# EAGLE design EIB-128 (EAGLE 7.1.0)
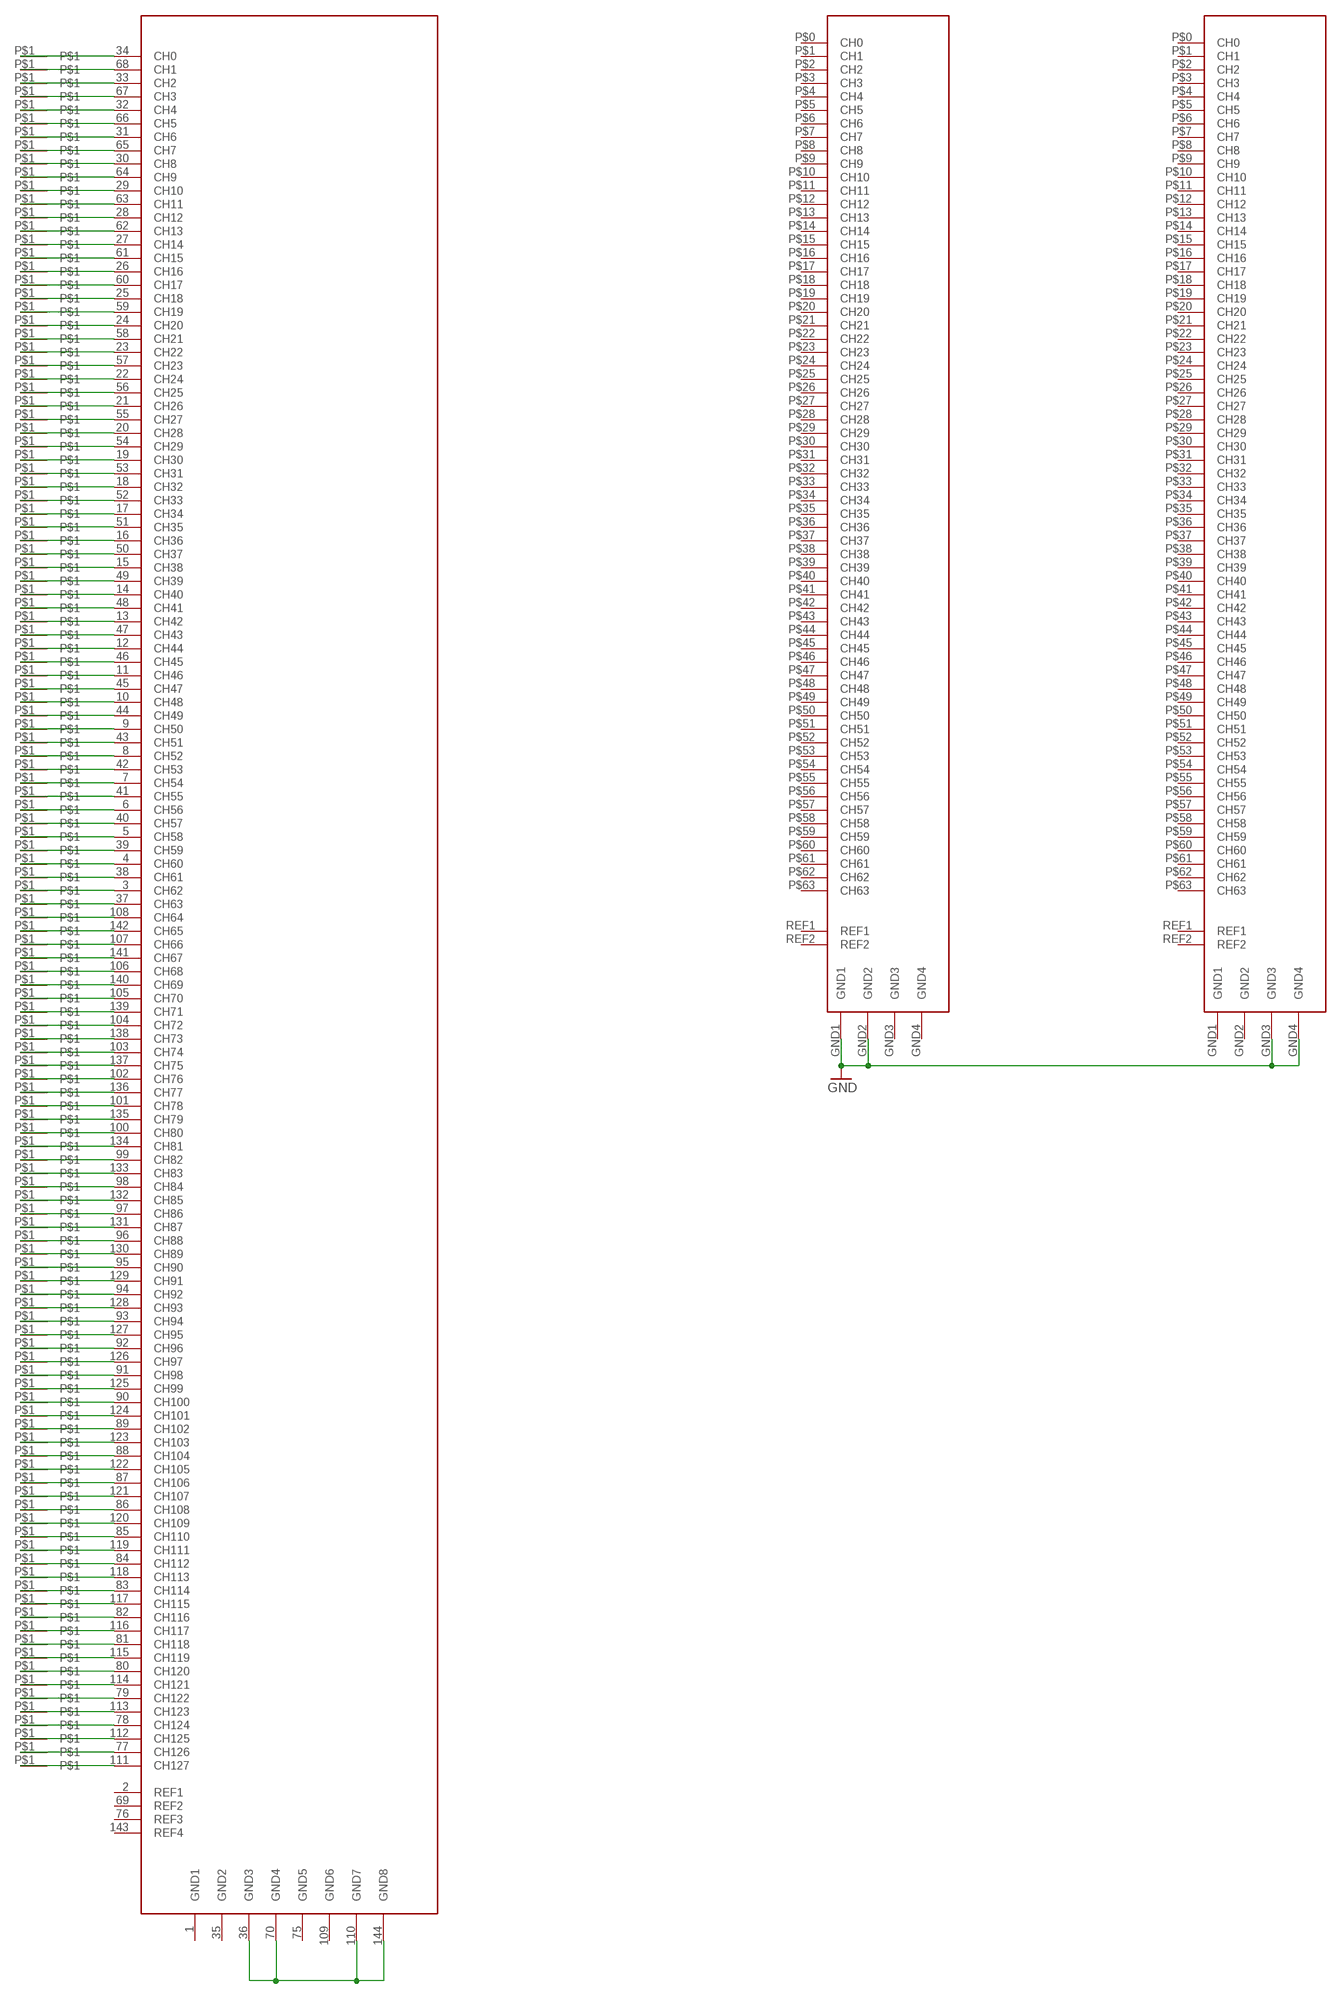
[diagram p0: schematic, sheet 1]

## Parts
H$0  TARRAYSHUTTLEHOLE  [TARRAYSHUTTLEHOLE]
H$1  TARRAYSHUTTLEHOLE  [TARRAYSHUTTLEHOLE]
H$2  TARRAYSHUTTLEHOLE  [TARRAYSHUTTLEHOLE]
H$3  TARRAYSHUTTLEHOLE  [TARRAYSHUTTLEHOLE]
H$4  TARRAYSHUTTLEHOLE  [TARRAYSHUTTLEHOLE]
H$5  TARRAYSHUTTLEHOLE  [TARRAYSHUTTLEHOLE]
H$6  TARRAYSHUTTLEHOLE  [TARRAYSHUTTLEHOLE]
H$7  TARRAYSHUTTLEHOLE  [TARRAYSHUTTLEHOLE]
H$8  TARRAYSHUTTLEHOLE  [TARRAYSHUTTLEHOLE]
H$9  TARRAYSHUTTLEHOLE  [TARRAYSHUTTLEHOLE]
H$10  TARRAYSHUTTLEHOLE  [TARRAYSHUTTLEHOLE]
H$11  TARRAYSHUTTLEHOLE  [TARRAYSHUTTLEHOLE]
H$12  TARRAYSHUTTLEHOLE  [TARRAYSHUTTLEHOLE]
H$13  TARRAYSHUTTLEHOLE  [TARRAYSHUTTLEHOLE]
H$14  TARRAYSHUTTLEHOLE  [TARRAYSHUTTLEHOLE]
H$15  TARRAYSHUTTLEHOLE  [TARRAYSHUTTLEHOLE]
H$16  TARRAYSHUTTLEHOLE  [TARRAYSHUTTLEHOLE]
H$17  TARRAYSHUTTLEHOLE  [TARRAYSHUTTLEHOLE]
H$18  TARRAYSHUTTLEHOLE  [TARRAYSHUTTLEHOLE]
H$19  TARRAYSHUTTLEHOLE  [TARRAYSHUTTLEHOLE]
H$20  TARRAYSHUTTLEHOLE  [TARRAYSHUTTLEHOLE]
H$21  TARRAYSHUTTLEHOLE  [TARRAYSHUTTLEHOLE]
H$22  TARRAYSHUTTLEHOLE  [TARRAYSHUTTLEHOLE]
H$23  TARRAYSHUTTLEHOLE  [TARRAYSHUTTLEHOLE]
H$24  TARRAYSHUTTLEHOLE  [TARRAYSHUTTLEHOLE]
H$25  TARRAYSHUTTLEHOLE  [TARRAYSHUTTLEHOLE]
H$26  TARRAYSHUTTLEHOLE  [TARRAYSHUTTLEHOLE]
H$27  TARRAYSHUTTLEHOLE  [TARRAYSHUTTLEHOLE]
H$28  TARRAYSHUTTLEHOLE  [TARRAYSHUTTLEHOLE]
H$29  TARRAYSHUTTLEHOLE  [TARRAYSHUTTLEHOLE]
H$30  TARRAYSHUTTLEHOLE  [TARRAYSHUTTLEHOLE]
H$31  TARRAYSHUTTLEHOLE  [TARRAYSHUTTLEHOLE]
H$32  TARRAYSHUTTLEHOLE  [TARRAYSHUTTLEHOLE]
H$33  TARRAYSHUTTLEHOLE  [TARRAYSHUTTLEHOLE]
H$34  TARRAYSHUTTLEHOLE  [TARRAYSHUTTLEHOLE]
H$35  TARRAYSHUTTLEHOLE  [TARRAYSHUTTLEHOLE]
H$36  TARRAYSHUTTLEHOLE  [TARRAYSHUTTLEHOLE]
H$37  TARRAYSHUTTLEHOLE  [TARRAYSHUTTLEHOLE]
H$38  TARRAYSHUTTLEHOLE  [TARRAYSHUTTLEHOLE]
H$39  TARRAYSHUTTLEHOLE  [TARRAYSHUTTLEHOLE]
H$40  TARRAYSHUTTLEHOLE  [TARRAYSHUTTLEHOLE]
H$41  TARRAYSHUTTLEHOLE  [TARRAYSHUTTLEHOLE]
H$42  TARRAYSHUTTLEHOLE  [TARRAYSHUTTLEHOLE]
H$43  TARRAYSHUTTLEHOLE  [TARRAYSHUTTLEHOLE]
H$44  TARRAYSHUTTLEHOLE  [TARRAYSHUTTLEHOLE]
H$45  TARRAYSHUTTLEHOLE  [TARRAYSHUTTLEHOLE]
H$46  TARRAYSHUTTLEHOLE  [TARRAYSHUTTLEHOLE]
H$47  TARRAYSHUTTLEHOLE  [TARRAYSHUTTLEHOLE]
H$48  TARRAYSHUTTLEHOLE  [TARRAYSHUTTLEHOLE]
H$49  TARRAYSHUTTLEHOLE  [TARRAYSHUTTLEHOLE]
H$50  TARRAYSHUTTLEHOLE  [TARRAYSHUTTLEHOLE]
H$51  TARRAYSHUTTLEHOLE  [TARRAYSHUTTLEHOLE]
H$52  TARRAYSHUTTLEHOLE  [TARRAYSHUTTLEHOLE]
H$53  TARRAYSHUTTLEHOLE  [TARRAYSHUTTLEHOLE]
H$54  TARRAYSHUTTLEHOLE  [TARRAYSHUTTLEHOLE]
H$55  TARRAYSHUTTLEHOLE  [TARRAYSHUTTLEHOLE]
H$56  TARRAYSHUTTLEHOLE  [TARRAYSHUTTLEHOLE]
H$57  TARRAYSHUTTLEHOLE  [TARRAYSHUTTLEHOLE]
H$58  TARRAYSHUTTLEHOLE  [TARRAYSHUTTLEHOLE]
H$59  TARRAYSHUTTLEHOLE  [TARRAYSHUTTLEHOLE]
H$60  TARRAYSHUTTLEHOLE  [TARRAYSHUTTLEHOLE]
H$61  TARRAYSHUTTLEHOLE  [TARRAYSHUTTLEHOLE]
H$62  TARRAYSHUTTLEHOLE  [TARRAYSHUTTLEHOLE]
H$63  TARRAYSHUTTLEHOLE  [TARRAYSHUTTLEHOLE]
H$64  TARRAYSHUTTLEHOLE  [TARRAYSHUTTLEHOLE]
H$65  TARRAYSHUTTLEHOLE  [TARRAYSHUTTLEHOLE]
H$66  TARRAYSHUTTLEHOLE  [TARRAYSHUTTLEHOLE]
H$67  TARRAYSHUTTLEHOLE  [TARRAYSHUTTLEHOLE]
H$68  TARRAYSHUTTLEHOLE  [TARRAYSHUTTLEHOLE]
H$69  TARRAYSHUTTLEHOLE  [TARRAYSHUTTLEHOLE]
H$70  TARRAYSHUTTLEHOLE  [TARRAYSHUTTLEHOLE]
H$71  TARRAYSHUTTLEHOLE  [TARRAYSHUTTLEHOLE]
H$72  TARRAYSHUTTLEHOLE  [TARRAYSHUTTLEHOLE]
H$73  TARRAYSHUTTLEHOLE  [TARRAYSHUTTLEHOLE]
H$74  TARRAYSHUTTLEHOLE  [TARRAYSHUTTLEHOLE]
H$75  TARRAYSHUTTLEHOLE  [TARRAYSHUTTLEHOLE]
H$76  TARRAYSHUTTLEHOLE  [TARRAYSHUTTLEHOLE]
H$77  TARRAYSHUTTLEHOLE  [TARRAYSHUTTLEHOLE]
H$78  TARRAYSHUTTLEHOLE  [TARRAYSHUTTLEHOLE]
H$79  TARRAYSHUTTLEHOLE  [TARRAYSHUTTLEHOLE]
H$80  TARRAYSHUTTLEHOLE  [TARRAYSHUTTLEHOLE]
H$81  TARRAYSHUTTLEHOLE  [TARRAYSHUTTLEHOLE]
H$82  TARRAYSHUTTLEHOLE  [TARRAYSHUTTLEHOLE]
H$83  TARRAYSHUTTLEHOLE  [TARRAYSHUTTLEHOLE]
H$84  TARRAYSHUTTLEHOLE  [TARRAYSHUTTLEHOLE]
H$85  TARRAYSHUTTLEHOLE  [TARRAYSHUTTLEHOLE]
H$86  TARRAYSHUTTLEHOLE  [TARRAYSHUTTLEHOLE]
H$87  TARRAYSHUTTLEHOLE  [TARRAYSHUTTLEHOLE]
H$88  TARRAYSHUTTLEHOLE  [TARRAYSHUTTLEHOLE]
H$89  TARRAYSHUTTLEHOLE  [TARRAYSHUTTLEHOLE]
H$90  TARRAYSHUTTLEHOLE  [TARRAYSHUTTLEHOLE]
H$91  TARRAYSHUTTLEHOLE  [TARRAYSHUTTLEHOLE]
H$92  TARRAYSHUTTLEHOLE  [TARRAYSHUTTLEHOLE]
H$93  TARRAYSHUTTLEHOLE  [TARRAYSHUTTLEHOLE]
H$94  TARRAYSHUTTLEHOLE  [TARRAYSHUTTLEHOLE]
H$95  TARRAYSHUTTLEHOLE  [TARRAYSHUTTLEHOLE]
H$96  TARRAYSHUTTLEHOLE  [TARRAYSHUTTLEHOLE]
H$97  TARRAYSHUTTLEHOLE  [TARRAYSHUTTLEHOLE]
H$98  TARRAYSHUTTLEHOLE  [TARRAYSHUTTLEHOLE]
H$99  TARRAYSHUTTLEHOLE  [TARRAYSHUTTLEHOLE]
H$100  TARRAYSHUTTLEHOLE  [TARRAYSHUTTLEHOLE]
H$101  TARRAYSHUTTLEHOLE  [TARRAYSHUTTLEHOLE]
H$102  TARRAYSHUTTLEHOLE  [TARRAYSHUTTLEHOLE]
H$103  TARRAYSHUTTLEHOLE  [TARRAYSHUTTLEHOLE]
H$104  TARRAYSHUTTLEHOLE  [TARRAYSHUTTLEHOLE]
H$105  TARRAYSHUTTLEHOLE  [TARRAYSHUTTLEHOLE]
H$106  TARRAYSHUTTLEHOLE  [TARRAYSHUTTLEHOLE]
H$107  TARRAYSHUTTLEHOLE  [TARRAYSHUTTLEHOLE]
H$108  TARRAYSHUTTLEHOLE  [TARRAYSHUTTLEHOLE]
H$109  TARRAYSHUTTLEHOLE  [TARRAYSHUTTLEHOLE]
H$110  TARRAYSHUTTLEHOLE  [TARRAYSHUTTLEHOLE]
H$111  TARRAYSHUTTLEHOLE  [TARRAYSHUTTLEHOLE]
H$112  TARRAYSHUTTLEHOLE  [TARRAYSHUTTLEHOLE]
H$113  TARRAYSHUTTLEHOLE  [TARRAYSHUTTLEHOLE]
H$114  TARRAYSHUTTLEHOLE  [TARRAYSHUTTLEHOLE]
H$115  TARRAYSHUTTLEHOLE  [TARRAYSHUTTLEHOLE]
H$116  TARRAYSHUTTLEHOLE  [TARRAYSHUTTLEHOLE]
H$117  TARRAYSHUTTLEHOLE  [TARRAYSHUTTLEHOLE]
H$118  TARRAYSHUTTLEHOLE  [TARRAYSHUTTLEHOLE]
H$119  TARRAYSHUTTLEHOLE  [TARRAYSHUTTLEHOLE]
H$120  TARRAYSHUTTLEHOLE  [TARRAYSHUTTLEHOLE]
H$121  TARRAYSHUTTLEHOLE  [TARRAYSHUTTLEHOLE]
H$122  TARRAYSHUTTLEHOLE  [TARRAYSHUTTLEHOLE]
H$123  TARRAYSHUTTLEHOLE  [TARRAYSHUTTLEHOLE]
H$124  TARRAYSHUTTLEHOLE  [TARRAYSHUTTLEHOLE]
H$125  TARRAYSHUTTLEHOLE  [TARRAYSHUTTLEHOLE]
H$126  TARRAYSHUTTLEHOLE  [TARRAYSHUTTLEHOLE]
H$127  TARRAYSHUTTLEHOLE  [TARRAYSHUTTLEHOLE]
U$1  DF40C-70DP  [DF40C-70DP]
U$2  DF40C-70DP  [DF40C-70DP]
U$3  128CH-MODULE  [128CH-MODULE]

## Nets
GND: U$1.GND1 U$1.GND2 U$2.GND3 U$2.GND4
N$1: H$0.P$1 U$3.34(CH0)
N$2: H$1.P$1 U$3.68(CH1)
N$3: H$2.P$1 U$3.33(CH2)
N$4: H$3.P$1 U$3.67(CH3)
N$5: H$4.P$1 U$3.32(CH4)
N$6: H$5.P$1 U$3.66(CH5)
N$7: H$6.P$1 U$3.31(CH6)
N$8: H$7.P$1 U$3.65(CH7)
N$9: H$8.P$1 U$3.30(CH8)
N$10: H$9.P$1 U$3.64(CH9)
N$11: H$10.P$1 U$3.29(CH10)
N$12: H$11.P$1 U$3.63(CH11)
N$13: H$12.P$1 U$3.28(CH12)
N$14: H$13.P$1 U$3.62(CH13)
N$15: H$14.P$1 U$3.27(CH14)
N$16: H$15.P$1 U$3.61(CH15)
N$17: H$16.P$1 U$3.26(CH16)
N$18: H$17.P$1 U$3.60(CH17)
N$19: H$18.P$1 U$3.25(CH18)
N$20: H$19.P$1 U$3.59(CH19)
N$21: H$20.P$1 U$3.24(CH20)
N$22: H$21.P$1 U$3.58(CH21)
N$23: H$22.P$1 U$3.23(CH22)
N$24: H$23.P$1 U$3.57(CH23)
N$25: H$24.P$1 U$3.22(CH24)
N$26: H$25.P$1 U$3.56(CH25)
N$27: H$26.P$1 U$3.21(CH26)
N$28: H$27.P$1 U$3.55(CH27)
N$29: H$28.P$1 U$3.20(CH28)
N$30: H$29.P$1 U$3.54(CH29)
N$31: H$30.P$1 U$3.19(CH30)
N$32: H$31.P$1 U$3.53(CH31)
N$33: H$32.P$1 U$3.18(CH32)
N$34: H$33.P$1 U$3.52(CH33)
N$35: H$34.P$1 U$3.17(CH34)
N$36: H$35.P$1 U$3.51(CH35)
N$37: H$36.P$1 U$3.16(CH36)
N$38: H$37.P$1 U$3.50(CH37)
N$39: H$38.P$1 U$3.15(CH38)
N$40: H$39.P$1 U$3.49(CH39)
N$41: H$40.P$1 U$3.14(CH40)
N$42: H$41.P$1 U$3.48(CH41)
N$43: H$42.P$1 U$3.13(CH42)
N$44: H$43.P$1 U$3.47(CH43)
N$45: H$44.P$1 U$3.12(CH44)
N$46: H$45.P$1 U$3.46(CH45)
N$47: H$46.P$1 U$3.11(CH46)
N$48: H$47.P$1 U$3.45(CH47)
N$49: H$48.P$1 U$3.10(CH48)
N$50: H$49.P$1 U$3.44(CH49)
N$51: H$50.P$1 U$3.9(CH50)
N$52: H$51.P$1 U$3.43(CH51)
N$53: H$52.P$1 U$3.8(CH52)
N$54: H$53.P$1 U$3.42(CH53)
N$55: H$54.P$1 U$3.7(CH54)
N$56: H$55.P$1 U$3.41(CH55)
N$57: H$56.P$1 U$3.6(CH56)
N$58: H$57.P$1 U$3.40(CH57)
N$59: H$58.P$1 U$3.5(CH58)
N$60: H$59.P$1 U$3.39(CH59)
N$61: H$60.P$1 U$3.4(CH60)
N$62: H$61.P$1 U$3.38(CH61)
N$63: H$62.P$1 U$3.3(CH62)
N$64: H$63.P$1 U$3.37(CH63)
N$65: H$64.P$1 U$3.108(CH64)
N$66: H$65.P$1 U$3.142(CH65)
N$67: H$66.P$1 U$3.107(CH66)
N$68: H$67.P$1 U$3.141(CH67)
N$69: H$68.P$1 U$3.106(CH68)
N$70: H$69.P$1 U$3.140(CH69)
N$71: H$70.P$1 U$3.105(CH70)
N$72: H$71.P$1 U$3.139(CH71)
N$73: H$72.P$1 U$3.104(CH72)
N$74: H$73.P$1 U$3.138(CH73)
N$75: H$74.P$1 U$3.103(CH74)
N$76: H$75.P$1 U$3.137(CH75)
N$77: H$76.P$1 U$3.102(CH76)
N$78: H$77.P$1 U$3.136(CH77)
N$79: H$78.P$1 U$3.101(CH78)
N$80: H$79.P$1 U$3.135(CH79)
N$81: H$80.P$1 U$3.100(CH80)
N$82: H$81.P$1 U$3.134(CH81)
N$83: H$82.P$1 U$3.99(CH82)
N$84: H$83.P$1 U$3.133(CH83)
N$85: H$84.P$1 U$3.98(CH84)
N$86: H$85.P$1 U$3.132(CH85)
N$87: H$86.P$1 U$3.97(CH86)
N$88: H$87.P$1 U$3.131(CH87)
N$89: H$88.P$1 U$3.96(CH88)
N$90: H$89.P$1 U$3.130(CH89)
N$91: H$90.P$1 U$3.95(CH90)
N$92: H$91.P$1 U$3.129(CH91)
N$93: H$92.P$1 U$3.94(CH92)
N$94: H$93.P$1 U$3.128(CH93)
N$95: H$94.P$1 U$3.93(CH94)
N$96: H$95.P$1 U$3.127(CH95)
N$97: H$96.P$1 U$3.92(CH96)
N$98: H$97.P$1 U$3.126(CH97)
N$99: H$98.P$1 U$3.91(CH98)
N$100: H$99.P$1 U$3.125(CH99)
N$101: H$100.P$1 U$3.90(CH100)
N$102: H$101.P$1 U$3.124(CH101)
N$103: H$102.P$1 U$3.89(CH102)
N$104: H$103.P$1 U$3.123(CH103)
N$105: H$104.P$1 U$3.88(CH104)
N$106: H$105.P$1 U$3.122(CH105)
N$107: H$106.P$1 U$3.87(CH106)
N$108: H$107.P$1 U$3.121(CH107)
N$109: H$108.P$1 U$3.86(CH108)
N$110: H$109.P$1 U$3.120(CH109)
N$111: H$110.P$1 U$3.85(CH110)
N$112: H$111.P$1 U$3.119(CH111)
N$113: H$112.P$1 U$3.84(CH112)
N$114: H$113.P$1 U$3.118(CH113)
N$115: H$114.P$1 U$3.83(CH114)
N$116: H$115.P$1 U$3.117(CH115)
N$117: H$116.P$1 U$3.82(CH116)
N$118: H$117.P$1 U$3.116(CH117)
N$119: H$118.P$1 U$3.81(CH118)
N$120: H$119.P$1 U$3.115(CH119)
N$121: H$120.P$1 U$3.80(CH120)
N$122: H$121.P$1 U$3.114(CH121)
N$123: H$122.P$1 U$3.79(CH122)
N$124: H$123.P$1 U$3.113(CH123)
N$125: H$124.P$1 U$3.78(CH124)
N$126: H$125.P$1 U$3.112(CH125)
N$127: H$126.P$1 U$3.77(CH126)
N$128: H$127.P$1 U$3.111(CH127)
N$130: U$3.36(GND3) U$3.70(GND4) U$3.110(GND7) U$3.144(GND8)
Unconnected: U$1.GND3 U$1.GND4 U$1.P$0(CH0) U$1.P$1(CH1) U$1.P$2(CH2) U$1.P$3(CH3) U$1.P$4(CH4) U$1.P$5(CH5) U$1.P$6(CH6) U$1.P$7(CH7) U$1.P$8(CH8) U$1.P$9(CH9) U$1.P$10(CH10) U$1.P$11(CH11) U$1.P$12(CH12) U$1.P$13(CH13) U$1.P$14(CH14) U$1.P$15(CH15) U$1.P$16(CH16) U$1.P$17(CH17) U$1.P$18(CH18) U$1.P$19(CH19) U$1.P$20(CH20) U$1.P$21(CH21) U$1.P$22(CH22) U$1.P$23(CH23) U$1.P$24(CH24) U$1.P$25(CH25) U$1.P$26(CH26) U$1.P$27(CH27) U$1.P$28(CH28) U$1.P$29(CH29) U$1.P$30(CH30) U$1.P$31(CH31) U$1.P$32(CH32) U$1.P$33(CH33) U$1.P$34(CH34) U$1.P$35(CH35) U$1.P$36(CH36) U$1.P$37(CH37) U$1.P$38(CH38) U$1.P$39(CH39) U$1.P$40(CH40) U$1.P$41(CH41) U$1.P$42(CH42) U$1.P$43(CH43) U$1.P$44(CH44) U$1.P$45(CH45) U$1.P$46(CH46) U$1.P$47(CH47) U$1.P$48(CH48) U$1.P$49(CH49) U$1.P$50(CH50) U$1.P$51(CH51) U$1.P$52(CH52) U$1.P$53(CH53) U$1.P$54(CH54) U$1.P$55(CH55) U$1.P$56(CH56) U$1.P$57(CH57) U$1.P$58(CH58) U$1.P$59(CH59) U$1.P$60(CH60) U$1.P$61(CH61) U$1.P$62(CH62) U$1.P$63(CH63) U$1.REF1 U$1.REF2 U$2.GND1 U$2.GND2 U$2.P$0(CH0) U$2.P$1(CH1) U$2.P$2(CH2) U$2.P$3(CH3) U$2.P$4(CH4) U$2.P$5(CH5) U$2.P$6(CH6) U$2.P$7(CH7) U$2.P$8(CH8) U$2.P$9(CH9) U$2.P$10(CH10) U$2.P$11(CH11) U$2.P$12(CH12) U$2.P$13(CH13) U$2.P$14(CH14) U$2.P$15(CH15) U$2.P$16(CH16) U$2.P$17(CH17) U$2.P$18(CH18) U$2.P$19(CH19) U$2.P$20(CH20) U$2.P$21(CH21) U$2.P$22(CH22) U$2.P$23(CH23) U$2.P$24(CH24) U$2.P$25(CH25) U$2.P$26(CH26) U$2.P$27(CH27) U$2.P$28(CH28) U$2.P$29(CH29) U$2.P$30(CH30) U$2.P$31(CH31) U$2.P$32(CH32) U$2.P$33(CH33) U$2.P$34(CH34) U$2.P$35(CH35) U$2.P$36(CH36) U$2.P$37(CH37) U$2.P$38(CH38) U$2.P$39(CH39) U$2.P$40(CH40) U$2.P$41(CH41) U$2.P$42(CH42) U$2.P$43(CH43) U$2.P$44(CH44) U$2.P$45(CH45) U$2.P$46(CH46) U$2.P$47(CH47) U$2.P$48(CH48) U$2.P$49(CH49) U$2.P$50(CH50) U$2.P$51(CH51) U$2.P$52(CH52) U$2.P$53(CH53) U$2.P$54(CH54) U$2.P$55(CH55) U$2.P$56(CH56) U$2.P$57(CH57) U$2.P$58(CH58) U$2.P$59(CH59) U$2.P$60(CH60) U$2.P$61(CH61) U$2.P$62(CH62) U$2.P$63(CH63) U$2.REF1 U$2.REF2 U$3.2(REF1) U$3.69(REF2) U$3.76(REF3) U$3.143(REF4)

## Power pins joined to a net without a drawn wire
GND1: U$3.1(GND1)
GND2: U$3.35(GND2)
GND5: U$3.75(GND5)
GND6: U$3.109(GND6)

## Library data of the parts
H$0 H$1-H$127 = drive-parts:TARRAYSHUTTLEHOLE
U$1 U$2 = DF40C-70DP for EIB:DF40C-70DP
U$3 = saanlima:128CH-MODULE

## Board
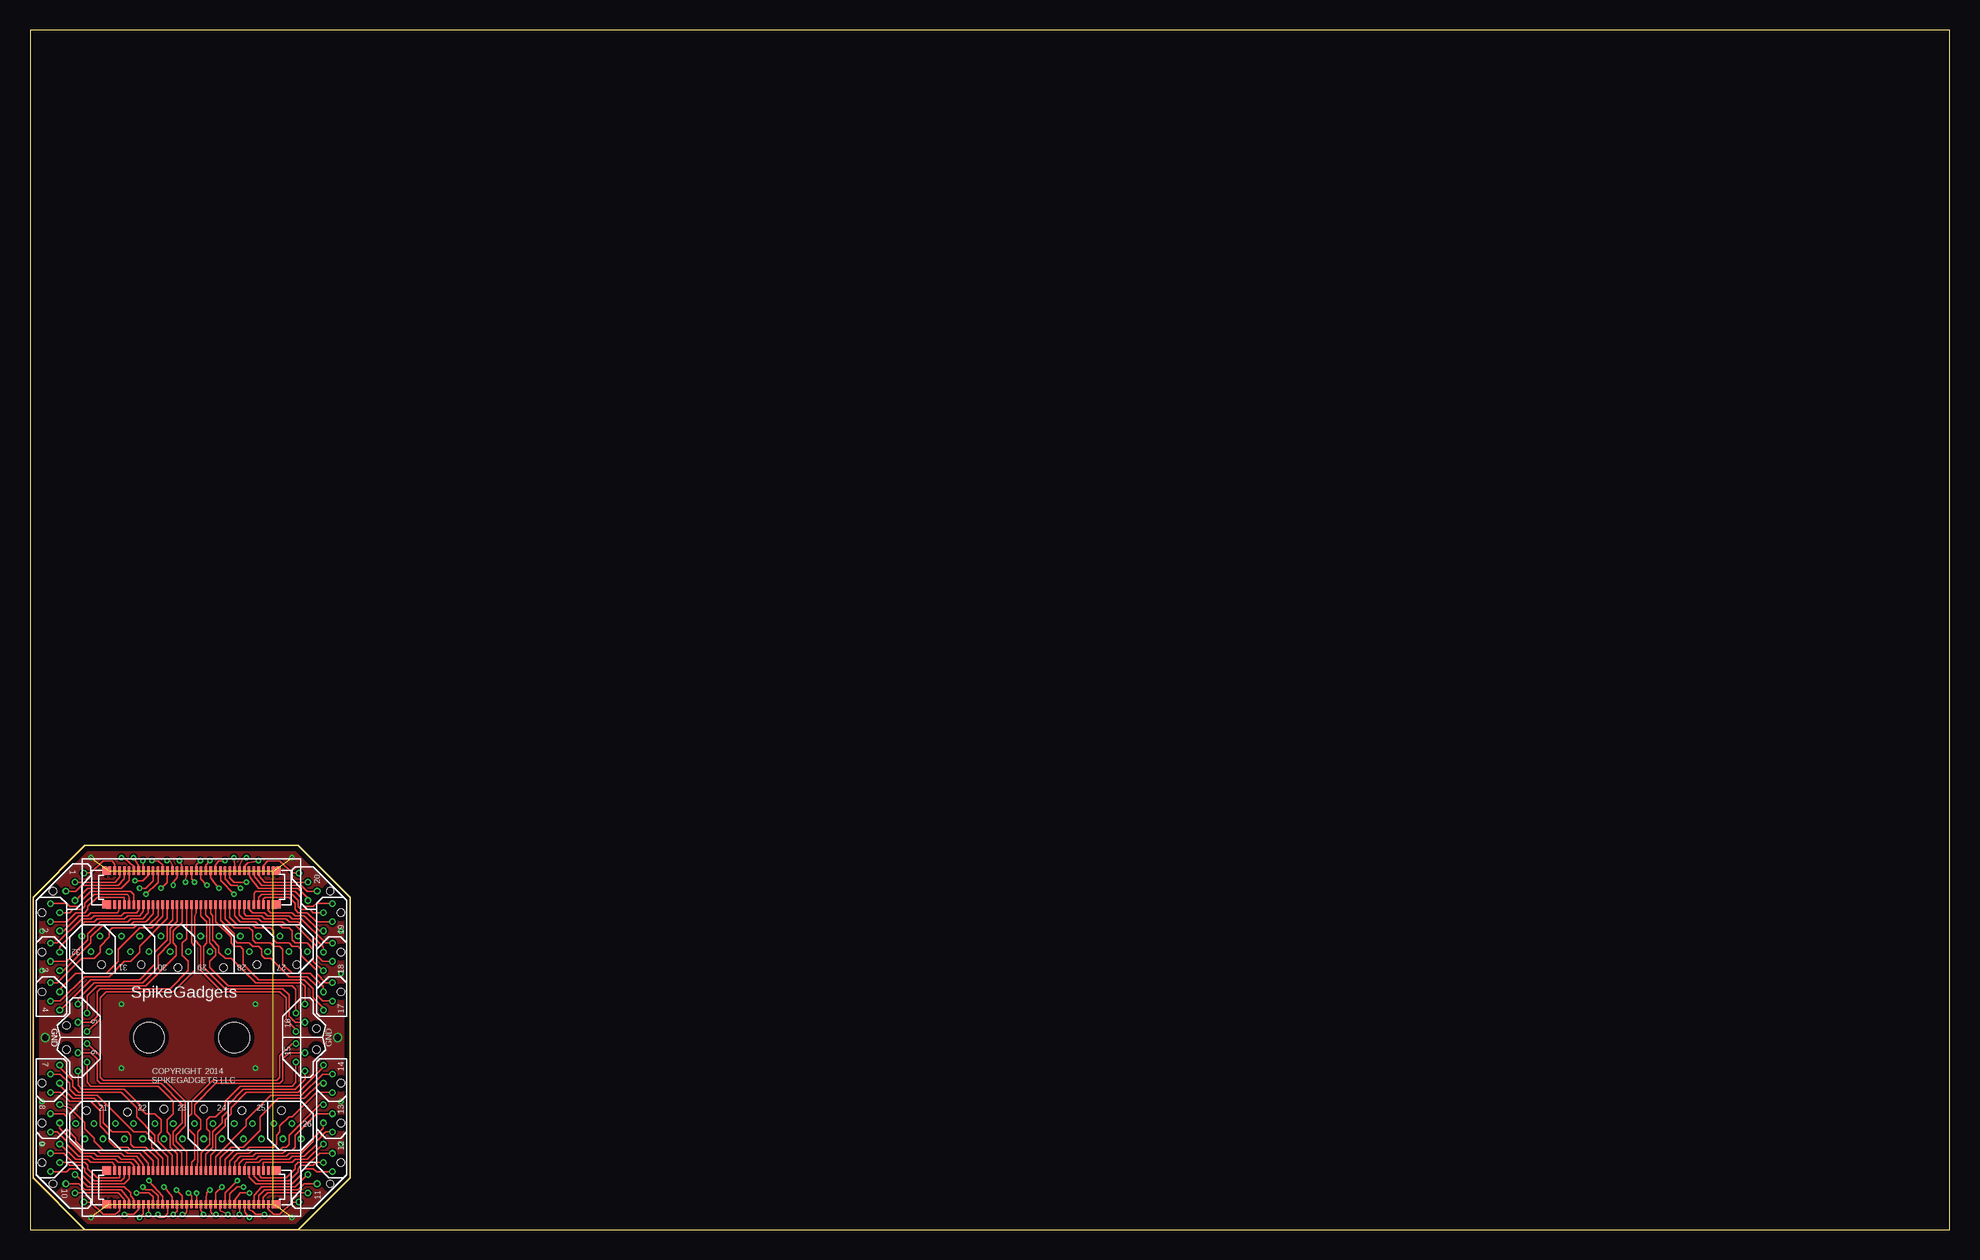
[diagram p1: board, top side]
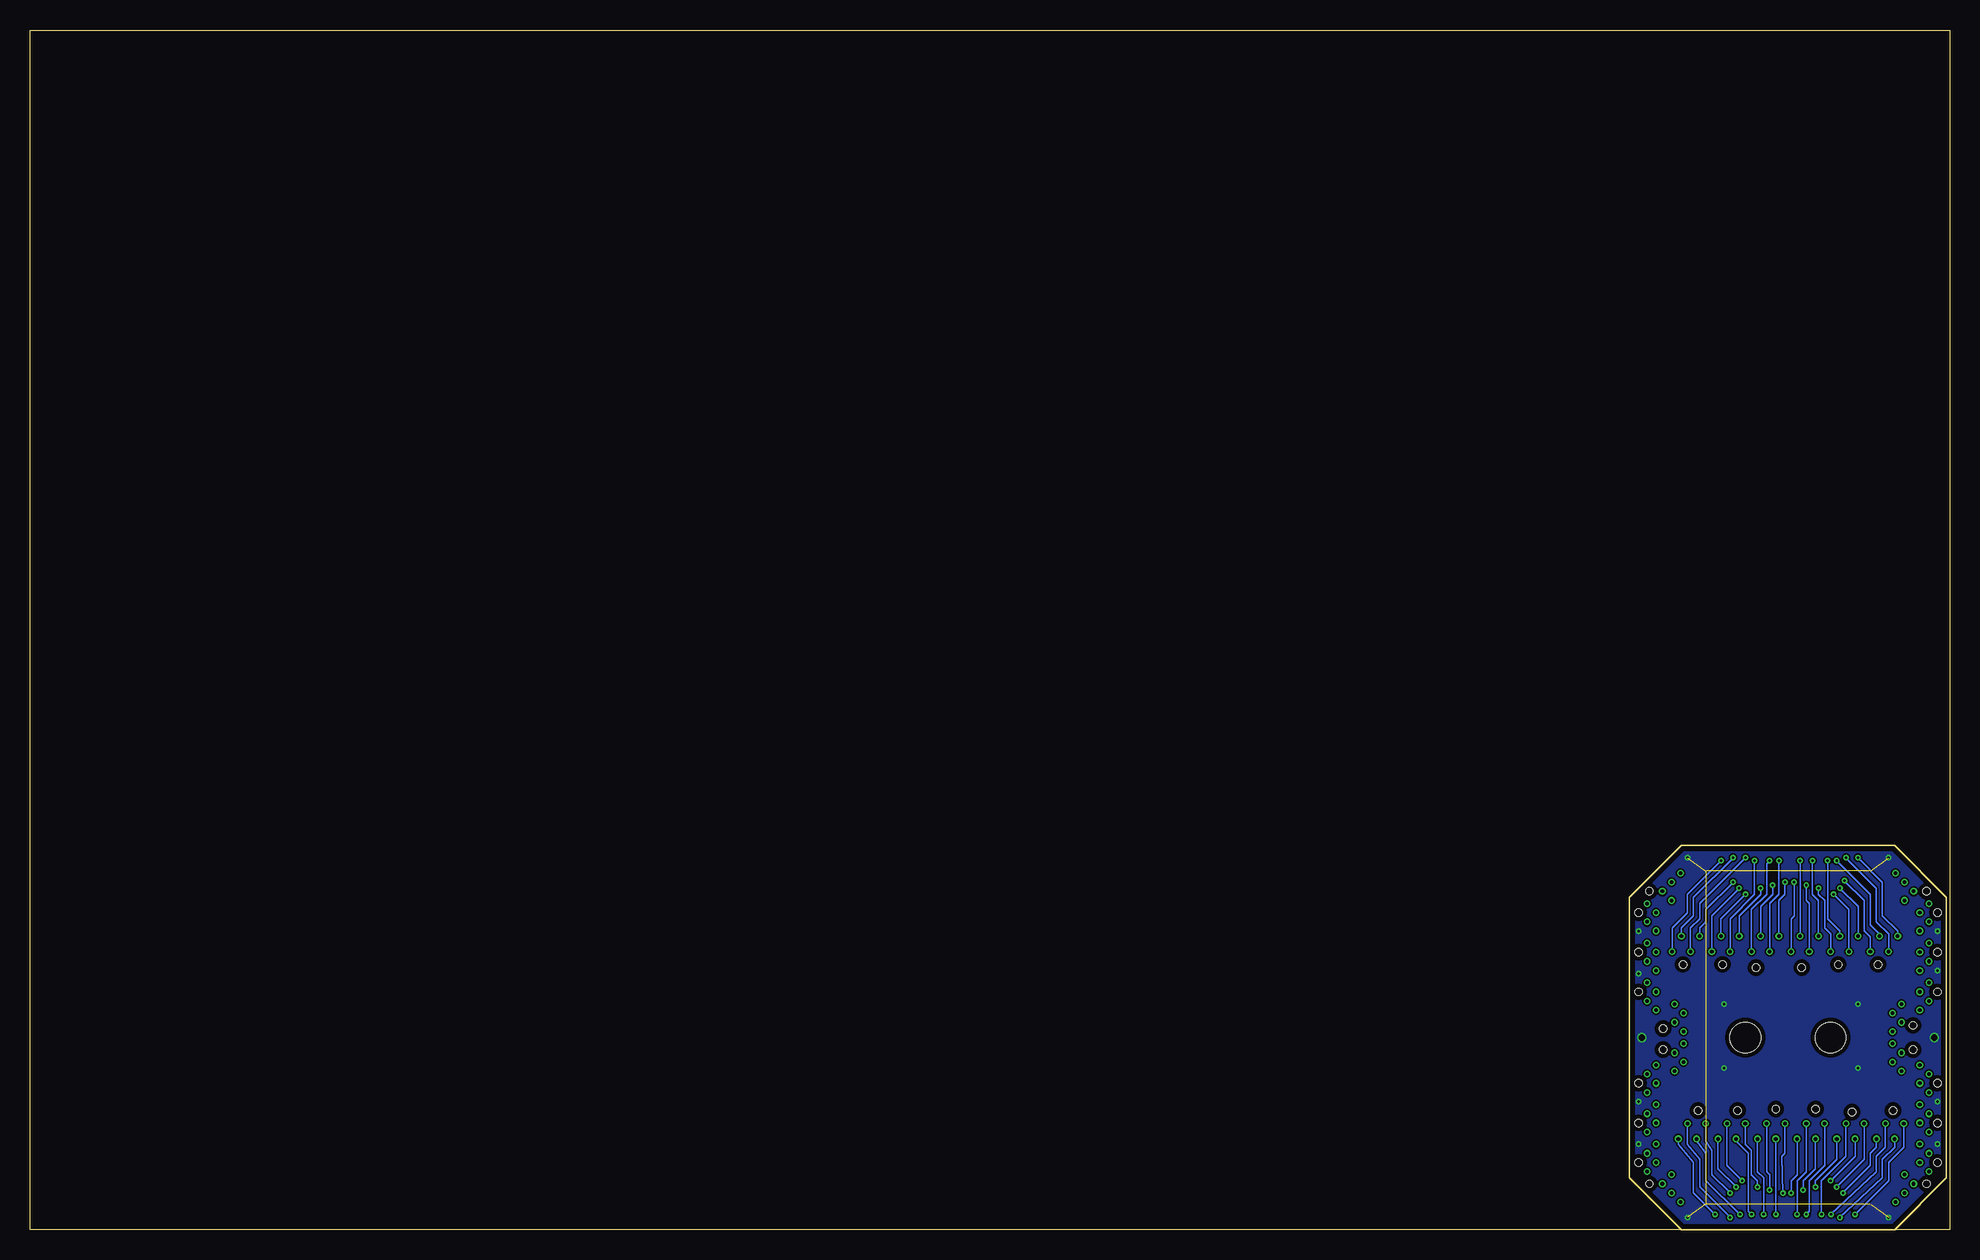
[diagram p2: board, bottom side, seen from below]

Size 160 x 100 mm. Coordinates in mm from the lower left corner, seen from the top.
Outline: 0,0 160,0 160,100 0,100 0,0
Outline: 0.25,27.69 0.25,4.32 4.57,0 22.35,0 26.67,4.32 26.67,27.69 22.35,32 4.57,32 0.25,27.69
Copper layers (1*16): Top 0.035mm / dielectric 1.5mm / Bottom 0.035mm
Design rules "DRC for EIB128": minimum track width 5mil, minimum drill 8mil, track to track 5mil, track to pad 5mil, pad to pad 5mil, via to via 5mil, smd to smd 5mil, copper to edge 15mil, drill to drill 8mil, minimum pad ring 5mil, minimum via ring 5mil, stop-mask expansion 4mil, vias tented up to drill 10mil, thermal gap 10mil
Holes 0.6 mm at 4.7,9.91 8.13,9.78 11.18,10.03 14.48,10.03 17.65,9.91 20.95,9.91 1.02,12.19 1.02,8.89 1.02,5.59 1.91,3.81 3.05,14.99 25.02,3.81 25.91,5.59 25.91,8.89 25.91,12.19 23.88,14.99 5.97,22.1 9.27,22.1 12.32,21.84 16.13,21.84 18.92,22.1 22.23,22.1 23.88,16.76 25.91,19.81 25.91,23.11 25.91,26.42 25.02,28.19 1.91,28.19 3.05,17.02 1.02,19.81 1.02,23.11 1.02,26.42
Holes 2.54 mm at 9.91,16 17.02,16

### Footprints (pad centres in the part's own frame; a part is rotated, then mirrored left to right if it is on the bottom)
TARRAYSHUTTLEHOLE = drill 0.3: P$1 0,2.223
DF40C-70DP = smd 0.4 x 0.7: GND1 -6.9,1.4; GND2 6.9,1.4; GND3 -6.9,-1.4; GND4 6.9,-1.4 | smd 0.2 x 0.7: P$0 -6.4,1.4; P$1 -6,-1.4; P$2 -6,1.4; P$3 -5.6,-1.4; P$4 -5.6,1.4; P$5 -5.2,-1.4; P$6 -5.2,1.4; P$7 -4.8,-1.4; P$8 -4.8,1.4; P$9 -4.4,-1.4; P$10 -4.4,1.4; P$11 -4,-1.4; P$12 -4,1.4; P$13 -3.6,-1.4; P$14 -3.6,1.4; P$15 -3.2,-1.4; P$16 -3.2,1.4; P$17 -2.8,-1.4; P$18 -2.8,1.4; P$19 -2.4,-1.4; P$20 -2.4,1.4; P$21 -2,-1.4; P$22 -2,1.4; P$23 -1.6,-1.4; P$24 -1.6,1.4; P$25 -1.2,-1.4; P$26 -1.2,1.4; P$27 -0.8,-1.4; P$28 -0.8,1.4; P$29 -0.4,-1.4; P$30 -0.4,1.4; P$31 0,-1.4; P$32 0,1.4; P$33 0.4,-1.4; P$34 0.4,1.4; P$35 0.8,-1.4; P$36 0.8,1.4; P$37 1.2,-1.4; P$38 1.2,1.4; P$39 1.6,-1.4; P$40 1.6,1.4; P$41 2,-1.4; P$42 2,1.4; P$43 2.4,-1.4; P$44 2.4,1.4; P$45 2.8,-1.4; P$46 2.8,1.4; P$47 3.2,-1.4; P$48 3.2,1.4; P$49 3.6,-1.4; P$50 3.6,1.4; P$51 4,-1.4; P$52 4,1.4; P$53 4.4,-1.4; P$54 4.4,1.4; P$55 4.8,-1.4; P$56 4.8,1.4; P$57 5.2,-1.4; P$58 5.2,1.4; P$59 5.6,-1.4; P$60 5.6,1.4; P$61 6,-1.4; P$62 6,1.4; P$63 6.4,-1.4; REF1 6.4,1.4; REF2 -6.4,-1.4
128CH-MODULE = smd 0.21 x 0.7: 1 -6.8,11.1; 2 -6.4,11.1; 3 -6,11.1; 4 -5.6,11.1; 5 -5.2,11.1; 6 -4.8,11.1; 7 -4.4,11.1; 8 -4,11.1; 9 -3.6,11.1; 10 -3.2,11.1; 11 -2.8,11.1; 12 -2.4,11.1; 13 -2,11.1; 14 -1.6,11.1; 15 -1.2,11.1; 16 -0.8,11.1; 17 -0.4,11.1; 18 0,11.1; 19 0.4,11.1; 20 0.8,11.1; 21 1.2,11.1; 22 1.6,11.1; 23 2,11.1; 24 2.4,11.1; 25 2.8,11.1; 26 3.2,11.1; 27 3.6,11.1; 28 4,11.1; 29 4.4,11.1; 30 4.8,11.1; 31 5.2,11.1; 32 5.6,11.1; 33 6,11.1; 34 6.4,11.1; 35 6.8,11.1; 36 -6.8,13.9; 37 -6.4,13.9; 38 -6,13.9; 39 -5.6,13.9; 40 -5.2,13.9; 41 -4.8,13.9; 42 -4.4,13.9; 43 -4,13.9; 44 -3.6,13.9; 45 -3.2,13.9; 46 -2.8,13.9; 47 -2.4,13.9; 48 -2,13.9; 49 -1.6,13.9; 50 -1.2,13.9; 51 -0.8,13.9; 52 -0.4,13.9; 53 0,13.9; 54 0.4,13.9; 55 0.8,13.9; 56 1.2,13.9; 57 1.6,13.9; 58 2,13.9; 59 2.4,13.9; 60 2.8,13.9; 61 3.2,13.9; 62 3.6,13.9; 63 4,13.9; 64 4.4,13.9; 65 4.8,13.9; 66 5.2,13.9; 67 5.6,13.9; 68 6,13.9; 69 6.4,13.9; 70 6.8,13.9; 75 6.8,-11.1; 76 6.4,-11.1; 77 6,-11.1; 78 5.6,-11.1; 79 5.2,-11.1; 80 4.8,-11.1; 81 4.4,-11.1; 82 4,-11.1; 83 3.6,-11.1; 84 3.2,-11.1; 85 2.8,-11.1; 86 2.4,-11.1; 87 2,-11.1; 88 1.6,-11.1; 89 1.2,-11.1; 90 0.8,-11.1; 91 0.4,-11.1; 92 0,-11.1; 93 -0.4,-11.1; 94 -0.8,-11.1; 95 -1.2,-11.1; 96 -1.6,-11.1; 97 -2,-11.1; 98 -2.4,-11.1; 99 -2.8,-11.1; 100 -3.2,-11.1; 101 -3.6,-11.1; 102 -4,-11.1; 103 -4.4,-11.1; 104 -4.8,-11.1; 105 -5.2,-11.1; 106 -5.6,-11.1; 107 -6,-11.1; 108 -6.4,-11.1; 109 -6.8,-11.1; 110 6.8,-13.9; 111 6.4,-13.9; 112 6,-13.9; 113 5.6,-13.9; 114 5.2,-13.9; 115 4.8,-13.9; 116 4.4,-13.9; 117 4,-13.9; 118 3.6,-13.9; 119 3.2,-13.9; 120 2.8,-13.9; 121 2.4,-13.9; 122 2,-13.9; 123 1.6,-13.9; 124 1.2,-13.9; 125 0.8,-13.9; 126 0.4,-13.9; 127 0,-13.9; 128 -0.4,-13.9; 129 -0.8,-13.9; 130 -1.2,-13.9; 131 -1.6,-13.9; 132 -2,-13.9; 133 -2.4,-13.9; 134 -2.8,-13.9; 135 -3.2,-13.9; 136 -3.6,-13.9; 137 -4,-13.9; 138 -4.4,-13.9; 139 -4.8,-13.9; 140 -5.2,-13.9; 141 -5.6,-13.9; 142 -6,-13.9; 143 -6.4,-13.9; 144 -6.8,-13.9 | smd 0.33 x 0.7: 71 -7.275,11.1; 72 7.275,11.1; 73 -7.275,13.9; 74 7.275,13.9; 145 7.275,-11.1; 146 -7.275,-11.1; 147 7.275,-13.9; 148 -7.275,-13.9

### Placement (x,y rotation side)
H$0  26.67,24.89 90 top
H$1  24.64,29.72 90 top
H$2  27.43,25.65 90 top
H$3  25.4,28.96 90 top
H$4  26.67,26.42 90 top
H$5  26.16,28.19 90 top
H$6  27.43,27.18 90 top
H$7  25.4,27.43 90 top
H$8  27.43,23.88 90 top
H$9  23.11,25.4 180 bottom
H$10  26.67,23.11 90 top
H$11  22.35,26.67 180 bottom
H$12  27.43,22.35 90 top
H$13  21.59,25.4 180 bottom
H$14  26.67,21.59 90 top
H$15  20.83,26.67 180 bottom
H$16  27.43,20.57 90 top
H$17  19.81,25.4 180 bottom
H$18  26.67,19.81 90 top
H$19  19.05,26.67 180 bottom
H$20  27.43,19.05 90 top
H$21  18.29,25.4 180 bottom
H$22  26.67,18.29 90 top
H$23  17.53,26.67 180 bottom
H$24  25.15,18.8 90 top
H$25  16.51,25.4 180 bottom
H$26  24.38,18.03 90 top
H$27  15.75,26.67 180 bottom
H$28  25.15,17.27 90 top
H$29  14.99,25.4 180 bottom
H$30  24.38,16.51 90 top
H$31  14.22,26.67 180 bottom
H$32  2.54,16.51 270 top
H$33  13.21,25.4 180 bottom
H$34  1.78,17.27 90 bottom
H$35  12.45,26.67 180 bottom
H$36  2.54,18.03 90 bottom
H$37  11.68,25.4 180 bottom
H$38  1.78,18.8 90 bottom
H$39  10.92,26.67 180 bottom
H$40  0.25,18.29 90 bottom
H$41  9.91,25.4 180 bottom
H$42  -0.51,19.05 90 bottom
H$43  9.14,26.67 180 bottom
H$44  0.25,19.81 90 bottom
H$45  8.38,25.4 180 bottom
H$46  -0.51,20.57 90 bottom
H$47  7.62,26.67 180 bottom
H$48  0.25,21.59 90 bottom
H$49  6.6,25.4 180 bottom
H$50  -0.51,22.35 90 bottom
H$51  5.84,26.67 180 bottom
H$52  0.25,23.11 90 bottom
H$53  5.08,25.4 180 bottom
H$54  -0.51,23.88 90 bottom
H$55  4.32,26.67 180 bottom
H$56  -0.51,27.18 90 bottom
H$57  1.52,27.43 90 bottom
H$58  0.25,26.42 90 bottom
H$59  0.76,28.19 90 bottom
H$60  -0.51,25.65 90 bottom
H$61  1.52,28.96 90 bottom
H$62  0.25,24.89 90 bottom
H$63  2.29,29.72 90 bottom
H$64  0.25,7.11 90 bottom
H$65  2.29,2.29 270 top
H$66  -0.51,6.35 90 bottom
H$67  1.52,3.05 270 top
H$68  0.25,5.59 90 bottom
H$69  0.76,3.81 270 top
H$70  -0.51,4.83 90 bottom
H$71  1.52,4.57 270 top
H$72  -0.51,8.13 90 bottom
H$73  3.81,6.6 0 top
H$74  0.25,8.89 90 bottom
H$75  4.57,5.33 0 top
H$76  -0.51,9.65 90 bottom
H$77  5.33,6.6 0 top
H$78  0.25,10.41 90 bottom
H$79  6.1,5.33 0 top
H$80  -0.51,11.43 90 bottom
H$81  7.11,6.6 0 top
H$82  0.25,12.19 90 bottom
H$83  7.87,5.33 0 top
H$84  -0.51,12.95 90 bottom
H$85  8.64,6.6 0 top
H$86  0.25,13.72 90 bottom
H$87  9.4,5.33 0 top
H$88  1.78,13.21 90 bottom
H$89  10.41,6.6 0 top
H$90  2.54,13.97 90 bottom
H$91  11.18,5.33 0 top
H$92  1.78,14.73 90 bottom
H$93  11.94,6.6 0 top
H$94  2.54,15.49 90 bottom
H$95  12.7,5.33 0 top
H$96  24.38,15.49 90 top
H$97  13.72,6.6 0 top
H$98  25.15,14.73 90 top
H$99  14.48,5.33 0 top
H$100  24.38,13.97 90 top
H$101  15.24,6.6 0 top
H$102  25.15,13.21 90 top
H$103  16,5.33 0 top
H$104  26.67,13.72 90 top
H$105  17.02,6.6 0 top
H$106  27.43,12.95 90 top
H$107  17.78,5.33 0 top
H$108  26.67,12.19 90 top
H$109  18.54,6.6 0 top
H$110  27.43,11.43 90 top
H$111  19.3,5.33 0 top
H$112  26.67,10.41 90 top
H$113  20.32,6.6 0 top
H$114  27.43,9.65 90 top
H$115  21.08,5.33 0 top
H$116  26.67,8.89 90 top
H$117  21.84,6.6 0 top
H$118  27.43,8.13 90 top
H$119  22.61,5.33 0 top
H$120  27.43,4.83 90 top
H$121  25.4,4.57 90 top
H$122  26.67,5.59 90 top
H$123  26.16,3.81 90 top
H$124  27.43,6.35 90 top
H$125  25.4,3.05 90 top
H$126  26.67,7.11 90 top
H$127  24.64,2.29 90 top
U$1  13.47,28.5 0 top
U$2  13.47,3.51 0 top
U$3  13.46,16 0 top

### Tracks (layer width: path | path; a pad name or v marks a point on that pad's centre or on a via)
GND  (via drill 0.2, 0.51)  (4 unrouted)
  other vias: 7.62,18.8 18.8,18.8 5.08,30.99 21.84,30.99 7.62,13.46 25.65,16 1.27,16 5.08,1.02 21.84,1.02 1.02,10.67 1.02,7.11 25.91,10.67 25.91,7.11 25.91,21.34 25.91,24.89 1.02,21.59 1.02,24.89 18.8,13.46
  pour Top: 22.1,31.5 4.83,31.5 0.76,27.43 0.76,4.57 4.83,0.51 22.1,0.51 26.16,4.57 26.16,27.43
  pour Bottom: 22.1,31.5 4.83,31.5 0.76,27.43 0.76,4.57 4.83,0.51 22.1,0.51 26.16,4.57 26.16,27.43
N$1
  Top 0.127: H$0.P$1 24.13,24.89 22.86,26.16 22.1,26.16 21.84,26.42 20.07,26.42 19.86,26.59 19.86,27.05 U$3.34
N$2
  Top 0.127: H$1.P$1 21.84,29.72 20.83,30.73 19.81,30.73 19.46,30.3 19.46,29.82 U$3.68
N$3
  Top 0.127: H$2.P$1 23.88,25.65 23.11,26.42 22.35,26.42 22.1,26.67 22.1,27.18 21.59,27.69 19.61,27.69 19.46,27.58 U$3.33
N$4
  Top 0.127: H$3.P$1 19.56,28.96 19.05,29.54 19.02,29.89 U$3.67
N$5
  Top 0.127: H$4.P$1 23.62,26.42 23.37,26.67 22.61,26.67 22.35,26.92 22.35,27.43 21.84,27.94 19.3,27.94 19.05,27.69 19.05,27.11 U$3.32
N$6
  Top 0.127: H$5.P$1 23.11,28.19 22.61,28.7 19.3,28.7 18.67,29.46 18.64,29.78 U$3.66
N$7
  Top 0.127: H$6.P$1 23.88,27.18 23.62,26.92 22.86,26.92 22.61,27.18 22.61,27.69 22.1,28.19 18.8,28.19 18.67,28.04 18.67,27.32 U$3.31
N$8
  Top 0.127: H$7.P$1 23.18,27.62 22.35,28.45 19.05,28.45 18.31,29.39 18.26,29.72 U$3.65
N$9
  Top 0.127: H$8.P$1 24.64,23.88 22.61,25.91 21.84,25.91 21.59,26.16 19.81,26.16 19.56,26.42 18.54,26.42 18.29,26.67 18.29,27.08 U$3.30
N$10  (via drill 0.2)
  Top 0.127: v19.05,30.73 18.14,30.56 17.86,30.28 17.86,30.04 U$3.64
  Bottom 0.127: H$9.P$1 23.11,25.15 21.84,26.42 21.84,27.94 v19.05,30.73
N$11
  Top 0.127: H$10.P$1 24.45,23.56 22.35,25.65 21.59,25.65 21.34,25.91 19.56,25.91 19.3,26.16 18.03,26.16 17.86,26.34 17.86,26.94 U$3.29
N$12  (via drill 0.2)
  Top 0.127: v18.03,30.99 17.78,30.99 17.48,30.38 17.45,30.07 U$3.63
  Bottom 0.127: H$11.P$1 22.35,25.15 21.34,26.16 21.34,27.69 v18.03,30.99
N$13
  Top 0.127: H$12.P$1 24.38,22.35 23.88,22.86 23.88,23.62 22.1,25.4 21.34,25.4 21.08,25.65 19.3,25.65 19.05,25.91 17.78,25.91 17.45,26.24 17.45,27.11 U$3.28
N$14  (via drill 0.2)
  Top 0.127: v17.02,30.99 17.07,30.18 U$3.62
  Bottom 0.127: H$13.P$1 21.59,25.15 20.83,25.91 20.83,27.18 v17.02,30.99
N$15
  Top 0.127: H$14.P$1 24.38,21.59 23.62,22.35 23.62,23.37 23.11,23.88 22.1,23.88 21.84,24.13 21.84,24.89 21.59,25.15 21.08,25.15 20.83,25.4 19.05,25.4 18.8,25.65 17.53,25.65 17.04,26.14 17.04,27.03 U$3.27
N$16  (via drill 0.2)
  Top 0.127: v18.03,28.96 17.02,28.96 16.66,29.31 U$3.61 | U$3.61
  Bottom 0.127: H$15.P$1 20.83,25.15 20.32,25.65 20.32,26.67 v18.03,28.96
N$17
  Top 0.127: H$16.P$1 24.64,20.57 23.88,21.34 23.88,21.59 22.61,22.86 22.61,23.37 22.35,23.62 21.84,23.62 21.59,23.88 20.57,23.88 20.32,24.13 20.32,24.89 20.07,25.15 18.8,25.15 18.54,25.4 17.27,25.4 16.66,26.04 16.66,27.13 U$3.26
N$18  (via drill 0.2)
  Top 0.127: v17.53,28.45 17.27,28.7 16.76,28.7 16.26,29.21 U$3.60
  Bottom 0.127: H$17.P$1 19.81,26.16 v17.53,28.45
N$19
  Top 0.127: H$18.P$1 24.45,20.26 23.37,21.34 21.84,21.34 21.08,22.1 21.08,23.37 20.83,23.62 20.32,23.62 20.07,23.88 18.8,23.88 18.54,24.13 18.54,24.89 18.29,25.15 17.02,25.15 16.26,25.91 U$3.25
N$20  (via drill 0.2)
  Top 0.127: v17.02,27.94 15.88,29.11 15.88,29.91 U$3.59
  Bottom 0.127: H$19.P$1 19.05,25.91 v17.02,27.94
N$21
  Top 0.127: H$20.P$1 24.38,19.05 23.88,19.56 23.88,20.32 23.11,21.08 21.59,21.08 20.07,22.61 19.56,22.61 19.3,22.86 19.3,23.37 19.05,23.62 18.54,23.62 18.29,23.88 17.27,23.88 17.02,24.13 17.02,24.64 15.88,25.76 15.88,26.71 U$3.24
N$22  (via drill 0.2)
  Top 0.127: v16.26,30.73 15.75,30.73 15.44,30.35 15.44,29.81 U$3.58
  Bottom 0.127: H$21.P$1 18.29,25.91 16.26,27.94 v16.26,30.73
N$23
  Top 0.127: H$22.P$1 24.45,18.48 23.62,19.3 23.62,20.07 22.86,20.83 19.05,20.83 17.78,22.1 17.78,23.37 17.53,23.62 17.02,23.62 16.76,23.88 16.76,24.38 15.49,25.65 15.49,26.66 U$3.23
N$24  (via drill 0.2)
  Top 0.127: v15.75,28.45 15.06,29.31 15.06,29.93 U$3.57
  Bottom 0.127: H$23.P$1 17.53,26.16 15.75,27.94 v15.75,28.45
N$25
  Top 0.127: H$24.P$1 22.92,20.26 22.61,20.57 18.8,20.57 16.76,22.61 16.26,22.61 15.75,23.11 15.75,23.62 15.24,24.13 15.24,26.16 15.06,26.36 15.06,26.8 U$3.22
N$26  (via drill 0.2)
  Top 0.127: v14.99,30.73 14.66,30.35 14.66,29.84 U$3.56
  Bottom 0.127: H$25.P$1 16.51,26.67 15.24,27.94 15.24,30.48 v14.99,30.73
N$27
  Top 0.127: H$26.P$1 22.16,20 21.84,20.32 16.51,20.32 14.99,21.84 14.99,22.35 15.49,22.86 15.49,23.37 14.99,23.88 14.99,25.91 14.66,26.24 14.66,27.13 U$3.21
N$28  (via drill 0.2)
  Top 0.127: v14.73,28.7 14.22,29.21 14.22,29.86 U$3.55
  Bottom 0.127: H$27.P$1 15.75,26.92 14.73,27.94 v14.73,28.7
N$29
  Top 0.127: H$28.P$1 22.1,17.27 21.59,17.78 21.59,19.56 21.08,20.07 16.26,20.07 14.48,21.84 14.48,23.62 14.73,23.88 14.73,25.65 14.22,26.16 14.22,27.06 U$3.20
N$30  (via drill 0.2)
  Top 0.127: v14.22,30.73 13.87,30.4 13.87,30.05 U$3.54
  Bottom 0.127: H$29.P$1 14.99,27.18 14.22,27.94 v14.22,30.73
N$31
  Top 0.127: H$30.P$1 22.16,16.7 21.34,17.53 21.34,19.3 20.83,19.81 16,19.81 14.22,21.59 14.22,23.62 13.72,24.13 13.72,26.16 13.87,26.42 13.87,26.99 U$3.19
N$32  (via drill 0.2)
  Top 0.127: v13.72,28.96 13.46,29.21 U$3.53
  Bottom 0.127: H$31.P$1 14.22,27.43 13.72,27.94 v13.72,28.96
N$33
  Top 0.127: H$32.P$1 4.83,16.51 5.84,17.53 5.84,19.3 6.35,19.81 11.94,19.81 13.72,21.59 13.72,23.62 13.46,23.88 U$3.18
N$34  (via drill 0.2)
  Top 0.127: v12.95,28.96 13.08,29.72 U$3.52
  Bottom 0.127: H$33.P$1 13.21,25.91 12.95,26.16 v12.95,28.96
N$35
  Top 0.127: H$34.P$1 5.08,17.27 5.59,17.78 5.59,19.81 5.84,20.07 11.68,20.07 13.21,21.59 13.21,22.35 12.7,22.86 12.7,23.88 13.08,24.23 13.08,26.74 U$3.17
N$36  (via drill 0.2)
  Top 0.127: v12.45,30.73 12.65,30.4 12.65,29.86 U$3.51
  Bottom 0.127: H$35.P$1 v12.45,30.73
N$37
  Top 0.127: H$36.P$1 4.76,19.49 5.59,20.32 9.65,20.32 12.19,22.86 12.19,23.62 11.94,23.88 11.94,24.89 12.68,25.6 12.68,27.01 U$3.16
N$38  (via drill 0.2)
  Top 0.127: v11.94,28.7 11.94,28.96 12.27,29.34 12.27,29.96 U$3.50
  Bottom 0.127: H$37.P$1 11.68,27.18 11.94,27.43 v11.94,28.7
N$39
  Top 0.127: H$38.P$1 4,19.24 5.33,20.57 9.4,20.57 10.67,21.84 10.67,22.86 11.68,23.88 11.68,25.12 12.27,25.7 12.27,27.06 U$3.15
N$40  (via drill 0.2)
  Top 0.127: v11.43,30.73 11.68,30.73 11.86,30.38 11.86,29.88 U$3.49
  Bottom 0.127: H$39.P$1 10.92,27.43 11.43,27.94 v11.43,30.73
N$41
  Top 0.127: H$40.P$1 2.54,18.29 5.08,20.83 9.14,20.83 10.41,22.1 10.41,23.11 11.43,24.13 11.43,25.38 11.89,25.83 11.89,26.95 U$3.14
N$42  (via drill 0.2)
  Top 0.127: v10.92,28.45 11.43,28.96 11.43,29.87 U$3.48
  Bottom 0.127: H$41.P$1 9.91,24.64 10.41,25.15 10.41,27.43 10.92,27.94 v10.92,28.45
N$43
  Top 0.127: U$3.13 11.46,25.93 9.14,23.62 9.14,23.11 8.38,22.35 7.87,22.35 6.6,21.08 4.57,21.08 2.54,19.05 H$42.P$1
N$44  (via drill 0.2)
  Top 0.127: v10.16,30.73 10.67,30.73 11.07,30.38 11.07,29.94 U$3.47
  Bottom 0.127: H$43.P$1 9.14,24.89 10.16,25.91 v10.16,30.73
N$45
  Top 0.127: U$3.12 11.07,26.91 11.07,26.09 10.16,25.15 9.14,25.15 7.37,23.37 7.37,22.35 6.35,21.34 3.81,21.34 2.48,20 H$44.P$1
N$46  (via drill 0.2)
  Top 0.127: v9.65,27.94 10.67,28.96 U$3.46
  Bottom 0.127: H$45.P$1 8.38,26.67 v9.65,27.94
N$47
  Top 0.127: U$3.11 10.67,26.16 9.91,25.4 8.89,25.4 8.64,25.15 6.86,25.15 6.6,24.89 6.6,24.38 5.84,23.62 5.84,23.11 5.33,22.61 4.32,22.61 2.29,20.57 H$46.P$1
N$48  (via drill 0.2)
  Top 0.127: v9.14,28.45 9.65,28.45 10.26,29.08 10.26,29.93 U$3.45
  Bottom 0.127: H$47.P$1 7.62,26.92 v9.14,28.45
N$49
  Top 0.127: H$48.P$1 2.79,21.59 5.08,23.88 5.08,24.38 6.1,25.4 8.38,25.4 8.64,25.65 9.65,25.65 10.26,26.31 10.26,27.2 U$3.10
N$50  (via drill 0.2)
  Top 0.127: v8.76,29.08 9.4,29.08 9.86,29.52 U$3.44
  Bottom 0.127: H$49.P$1 6.6,24.38 7.11,24.89 7.11,27.43 v8.76,29.08
N$51
  Top 0.127: H$50.P$1 3.05,22.35 4.83,24.13 4.83,24.64 5.84,25.65 8.13,25.65 8.38,25.91 9.4,25.91 9.86,26.42 9.86,27.13 U$3.9
N$52  (via drill 0.2)
  Top 0.127: v9.4,30.73 9.47,30.04 U$3.43
  Bottom 0.127: H$51.P$1 5.84,24.64 6.6,25.4 6.6,27.94 v9.4,30.73
N$53
  Top 0.127: H$52.P$1 2.48,23.56 4.57,25.65 5.33,25.65 5.59,25.91 7.87,25.91 8.13,26.16 9.14,26.16 9.45,26.52 9.45,27.16 U$3.8
N$54  (via drill 0.2)
  Top 0.127: v8.64,30.99 9.04,30.3 9.04,29.81 U$3.42
  Bottom 0.127: H$53.P$1 5.08,24.64 6.1,25.65 6.1,28.45 v8.64,30.99
N$55
  Top 0.127: H$54.P$1 2.29,23.88 4.32,25.91 5.08,25.91 5.33,26.16 7.62,26.16 7.87,26.42 8.89,26.42 9.07,26.64 9.07,27.02 U$3.7
N$56  (via drill 0.2)
  Top 0.127: v7.62,30.99 7.87,30.99 8.38,30.48 8.66,30.3 8.66,29.75 U$3.41
  Bottom 0.127: H$55.P$1 4.32,24.89 5.59,26.16 5.59,28.96 v7.62,30.99
N$57
  Top 0.127: H$56.P$1 3.05,27.18 3.3,26.92 4.06,26.92 4.32,27.18 4.32,27.43 5.08,28.19 8.38,28.19 8.64,27.94 8.64,27.13 U$3.6
N$58
  Top 0.127: H$57.P$1 3.81,27.43 4.83,28.45 7.62,28.45 8.26,29.11 8.26,29.92 U$3.40
N$59
  Top 0.127: H$58.P$1 3.3,26.42 3.56,26.67 4.32,26.67 4.57,26.92 4.57,27.18 5.33,27.94 8.13,27.94 8.26,27.69 8.26,27.22 U$3.5
N$60
  Top 0.127: H$59.P$1 3.81,28.19 4.32,28.7 7.37,28.7 7.87,29.21 7.87,29.89 U$3.39
N$61
  Top 0.127: H$60.P$1 3.05,25.65 3.81,26.42 4.57,26.42 4.83,26.67 4.83,26.92 5.59,27.69 7.87,27.69 7.87,27.11 U$3.4
N$62
  Top 0.127: H$61.P$1 7.11,28.96 7.47,29.39 7.47,29.98 U$3.38
N$63
  Top 0.127: H$62.P$1 2.79,24.89 4.06,26.16 4.83,26.16 5.08,26.42 7.32,26.42 7.47,26.8 U$3.3
N$64
  Top 0.127: H$63.P$1 5.08,29.72 6.1,30.73 6.86,30.73 7.06,30.43 U$3.37
N$65
  Top 0.127: H$64.P$1 2.54,7.11 3.81,5.84 4.83,5.84 5.08,5.59 6.86,5.59 7.06,5.33 7.06,4.95 U$3.108
N$66
  Top 0.127: H$65.P$1 5.08,2.29 6.1,1.27 7.11,1.27 7.47,1.55 7.47,1.98 U$3.142
N$67
  Top 0.127: H$66.P$1 2.79,6.35 3.56,5.59 4.57,5.59 4.83,5.33 4.83,5.08 5.59,4.32 7.47,4.32 7.47,4.81 U$3.107
N$68
  Top 0.127: H$67.P$1 7.37,3.05 7.87,2.54 7.87,2.11 U$3.141
N$69
  Top 0.127: H$68.P$1 3.05,5.59 3.3,5.33 4.32,5.33 4.57,5.08 4.57,4.83 5.33,4.06 7.62,4.06 7.87,4.32 7.87,4.89 U$3.106
N$70
  Top 0.127: H$69.P$1 4.06,3.81 4.57,3.3 7.62,3.3 8.28,2.49 8.28,1.93 U$3.140
N$71
  Top 0.127: H$70.P$1 3.05,4.83 3.3,5.08 4.06,5.08 4.32,4.83 4.32,4.57 5.08,3.81 7.87,3.81 8.26,4.22 8.26,4.92 U$3.105
N$72
  Top 0.127: H$71.P$1 3.81,4.57 4.83,3.56 7.87,3.56 8.38,3.05 8.38,2.79 8.64,2.54 8.64,2.13 U$3.139
N$73
  Top 0.127: H$72.P$1 2.29,8.13 3.05,7.37 3.05,7.11 4.06,6.1 5.08,6.1 5.33,5.84 7.11,5.84 7.37,5.59 8.38,5.59 8.64,5.33 8.64,4.93 U$3.104
N$74  (via drill 0.2)
  Top 0.127: v7.87,1.27 8.64,1.27 9.07,1.7 9.07,1.94 U$3.138
  Bottom 0.127: H$73.P$1 3.81,6.86 5.08,5.59 5.08,4.06 v7.87,1.27
N$75
  Top 0.127: H$74.P$1 2.48,8.45 3.3,7.62 3.3,7.37 4.32,6.35 5.33,6.35 5.59,6.1 7.37,6.1 7.62,5.84 8.64,5.84 9.07,5.41 U$3.103
N$76  (via drill 0.2)
  Top 0.127: v9.14,1.02 9.45,1.32 9.45,2.09 U$3.137
  Bottom 0.127: H$75.P$1 4.57,6.86 5.59,5.84 5.59,4.32 v9.14,1.02
N$77
  Top 0.127: H$76.P$1 2.79,9.65 3.05,9.4 3.05,8.38 3.81,7.62 3.81,7.37 4.57,6.6 5.59,6.6 5.84,6.35 7.62,6.35 7.87,6.1 8.89,6.1 9.45,5.38 9.45,4.94 U$3.102
N$78  (via drill 0.2)
  Top 0.127: v9.88,1.27 9.88,2.01 U$3.136
  Bottom 0.127: H$77.P$1 5.33,6.86 6.1,6.1 6.1,4.83 v9.88,1.27
N$79
  Top 0.127: H$78.P$1 3.3,10.16 4.57,8.89 4.57,8.38 5.33,7.62 5.33,7.37 6.1,6.6 7.87,6.6 8.13,6.35 9.14,6.35 9.86,5.54 U$3.101
N$80  (via drill 0.2)
  Top 0.127: v8.89,3.05 9.91,3.05 10.26,2.72 10.26,2.13 U$3.135
  Bottom 0.127: H$79.P$1 6.1,6.86 6.6,6.35 6.6,5.33 v8.89,3.05
N$81
  Top 0.127: H$80.P$1 2.54,11.43 3.3,10.67 5.08,10.67 5.84,9.91 5.84,8.64 6.6,7.87 6.6,7.37 7.11,6.86 8.13,6.86 8.38,6.6 9.4,6.6 10.26,5.71 10.26,4.88 U$3.100
N$82  (via drill 0.2)
  Top 0.127: v9.4,3.56 9.65,3.3 10.16,3.3 10.67,2.79 U$3.134
  Bottom 0.127: H$81.P$1 7.11,5.84 v9.4,3.56
N$83
  Top 0.127: H$82.P$1 2.48,12 3.56,10.92 5.33,10.92 6.1,10.16 6.1,8.89 6.86,8.13 8.13,8.13 8.38,7.87 8.38,7.11 8.64,6.86 9.65,6.86 10.67,5.84 U$3.99
N$84  (via drill 0.2)
  Top 0.127: v9.91,4.06 11.07,2.77 11.07,2.19 U$3.133
  Bottom 0.127: H$83.P$1 7.87,6.1 v9.91,4.06
N$85
  Top 0.127: H$84.P$1 2.54,12.95 3.3,12.19 3.3,11.68 3.81,11.18 5.59,11.18 8.64,8.13 9.65,8.13 10.16,7.62 10.16,6.86 11.07,5.92 11.07,4.86 U$3.98
N$86  (via drill 0.2)
  Top 0.127: v10.67,1.27 10.67,1.02 11.18,1.02 11.48,1.37 11.48,2.17 U$3.132
  Bottom 0.127: H$85.P$1 8.64,6.1 10.67,4.06 v10.67,1.27
N$87
  Top 0.127: H$86.P$1 2.48,13.53 3.56,12.45 3.56,11.94 4.06,11.43 7.62,11.43 8.89,10.16 8.89,9.4 10.41,7.87 10.41,7.11 11.48,6.04 11.48,4.88 U$3.97
N$88  (via drill 0.2)
  Top 0.127: v11.18,3.56 11.86,2.74 11.86,2.13 U$3.131
  Bottom 0.127: H$87.P$1 9.4,5.84 11.18,4.06 v11.18,3.56
N$89
  Top 0.127: H$88.P$1 4,12 4.32,11.68 7.87,11.68 9.14,10.41 9.14,10.16 9.65,9.65 10.41,9.65 10.92,9.14 10.92,8.13 10.67,7.87 10.67,7.37 11.86,6.17 11.86,5.05 U$3.96
N$90  (via drill 0.2)
  Top 0.127: v11.94,1.27 12.27,1.52 12.27,2.03 U$3.130
  Bottom 0.127: H$89.P$1 10.41,5.33 11.68,4.06 11.68,1.52 v11.94,1.27
N$91
  Top 0.127: H$90.P$1 4.76,12.26 5.08,11.94 10.67,11.94 11.94,10.67 11.94,9.65 11.43,9.14 11.43,8.13 11.68,7.87 11.68,6.86 12.27,6.3 12.27,4.92 U$3.95
N$92  (via drill 0.2)
  Top 0.127: v12.19,3.3 12.7,2.79 12.7,2.14 U$3.129
  Bottom 0.127: H$91.P$1 11.18,5.08 12.19,4.06 v12.19,3.3
N$93
  Top 0.127: H$92.P$1 5.08,14.73 5.59,14.22 5.59,12.45 5.84,12.19 10.92,12.19 12.7,10.41 12.7,8.89 11.94,8.13 11.94,7.11 12.65,6.4 12.65,4.99 U$3.94
N$94  (via drill 0.2)
  Top 0.127: v12.7,1.27 12.95,1.27 13.08,1.5 13.08,1.93 U$3.128
  Bottom 0.127: H$93.P$1 11.94,4.83 12.7,4.06 v12.7,1.27
N$95
  Top 0.127: H$94.P$1 4.83,15.49 5.84,14.48 5.84,12.7 6.1,12.45 11.18,12.45 12.95,10.67 12.95,8.64 12.19,7.87 12.19,7.37 13.06,6.48 13.06,4.88 U$3.93
N$96  (via drill 0.2)
  Top 0.127: v13.21,3.05 13.46,2.79 U$3.127
  Bottom 0.127: H$95.P$1 12.7,4.57 13.21,4.06 v13.21,3.05
N$97
  Top 0.127: H$96.P$1 21.84,15.49 20.83,14.48 20.83,12.7 20.57,12.45 15.24,12.45 13.46,10.67 13.46,9.65 13.21,9.4 13.21,8.38 13.72,7.87 13.72,5.84 13.46,5.59 U$3.92
N$98  (via drill 0.2)
  Top 0.127: v13.89,3.02 13.89,2.19 U$3.126
  Bottom 0.127: H$97.P$1 13.72,6.35 13.97,6.1 v13.89,3.02
N$99
  Top 0.127: H$98.P$1 21.59,14.73 21.08,14.22 21.08,12.45 20.83,12.19 15.49,12.19 13.72,10.41 13.72,9.65 14.22,9.14 14.22,8.38 13.97,8.13 13.97,5.64 U$3.91
N$100  (via drill 0.2)
  Top 0.127: v14.48,1.27 14.25,1.6 14.22,2.06 U$3.125
  Bottom 0.127: H$99.P$1 v14.48,1.27
N$101
  Top 0.127: H$100.P$1 22.16,12.26 21.84,11.94 17.53,11.94 16.26,10.67 16.26,10.16 15.49,9.4 14.99,9.4 14.73,9.14 14.73,8.38 14.99,8.13 14.99,7.11 14.28,6.4 14.28,4.99 U$3.90
N$102  (via drill 0.2)
  Top 0.127: v14.99,3.3 14.73,3.05 14.66,2.2 U$3.124
  Bottom 0.127: H$101.P$1 15.24,4.83 14.99,4.57 v14.99,3.3
N$103
  Top 0.127: H$102.P$1 22.92,12.51 22.1,11.68 17.78,11.68 16.51,10.41 16.51,9.91 16,9.4 16,8.89 15.24,8.13 15.24,6.86 14.66,6.27 14.66,5.26 U$3.89
N$104  (via drill 0.2)
  Top 0.127: v15.49,1.27 15.24,1.27 15.06,1.5 15.06,2 U$3.123
  Bottom 0.127: H$103.P$1 16,4.83 15.49,4.32 v15.49,1.27
N$105
  Top 0.127: H$104.P$1 24.45,13.53 22.35,11.43 18.03,11.43 16.76,10.16 16.76,9.65 16.26,9.14 16.26,8.64 15.49,7.87 15.49,6.6 15.06,6.17 15.06,5.05 U$3.88
N$106  (via drill 0.2)
  Top 0.127: v16,3.56 15.49,3.05 15.49,2.13 U$3.122
  Bottom 0.127: H$105.P$1 17.02,7.11 16.51,6.6 16.51,4.57 16,4.06 v16,3.56
N$107
  Top 0.127: H$106.P$1 24.38,12.95 22.61,11.18 20.07,11.18 18.03,9.14 18.03,8.64 15.47,6.07 U$3.87
N$108  (via drill 0.2)
  Top 0.127: v16.51,1.27 15.85,1.57 15.85,2.27 U$3.121
  Bottom 0.127: H$107.P$1 17.72,7.3 16.76,6.35 16.76,1.52 v16.51,1.27
N$109
  Top 0.127: H$108.P$1 24.13,12.19 22.86,10.92 20.7,10.92 19.18,9.4 19.18,8.26 17.78,6.86 16.76,6.86 15.85,5.97 15.85,4.92 U$3.86
N$110  (via drill 0.2)
  Top 0.127: v17.27,4.06 16.26,3.05 U$3.120
  Bottom 0.127: H$109.P$1 18.54,5.33 v17.27,4.06
N$111
  Top 0.127: H$110.P$1 23.88,11.43 21.84,9.4 21.59,9.4 20.83,8.64 20.83,8.13 20.57,7.87 20.57,7.11 20.32,6.86 18.29,6.86 18.03,6.6 17.02,6.6 16.26,5.84 U$3.85
N$112  (via drill 0.2)
  Top 0.127: v17.78,3.56 17.27,3.56 16.66,2.97 16.66,2.13 U$3.119
  Bottom 0.127: H$111.P$1 19.3,5.08 v17.78,3.56
N$113
  Top 0.127: U$3.84 16.66,4.85 16.66,5.69 17.27,6.35 18.29,6.35 18.54,6.6 20.83,6.6 21.08,6.86 21.34,6.86 21.59,7.11 21.59,7.87 24.13,10.41 H$112.P$1
N$114  (via drill 0.2)
  Top 0.127: v18.29,3.05 17.53,3.05 17.07,2.44 17.07,2.04 U$3.118
  Bottom 0.127: H$113.P$1 20.32,7.37 19.81,6.6 19.81,4.57 v18.29,3.05
N$115
  Top 0.127: H$114.P$1 23.88,9.65 22.1,7.87 22.1,6.86 21.84,6.6 21.34,6.6 21.08,6.35 18.8,6.35 18.54,6.1 17.53,6.1 17.07,5.61 17.07,4.97 U$3.83
N$116  (via drill 0.2)
  Top 0.127: v17.48,1.27 17.48,2.04 U$3.117
  Bottom 0.127: H$115.P$1 21.02,7.3 20.32,6.35 20.32,4.06 v17.48,1.27
N$117
  Top 0.127: H$116.P$1 24.45,8.45 23.62,7.62 23.62,7.37 22.61,6.35 21.59,6.35 21.34,6.1 19.05,6.1 18.8,5.84 17.78,5.84 17.45,5.51 U$3.82
N$118  (via drill 0.2)
  Top 0.127: v18.29,1.02 17.88,1.5 17.88,2.16 U$3.116
  Bottom 0.127: H$117.P$1 21.84,7.11 20.83,5.84 20.83,3.56 v18.29,1.02
N$119
  Top 0.127: H$118.P$1 24.64,8.13 23.88,7.37 23.88,7.11 22.86,6.1 21.84,6.1 21.59,5.84 19.3,5.84 19.05,5.59 18.03,5.59 17.86,5.28 17.86,4.93 U$3.81
N$120  (via drill 0.2)
  Top 0.127: v19.56,1.27 18.8,1.27 18.54,1.52 18.26,1.63 18.26,2.18 U$3.115
  Bottom 0.127: H$119.P$1 22.61,7.11 21.34,5.59 21.34,3.05 v19.56,1.27
N$121
  Top 0.127: H$120.P$1 23.88,4.83 23.62,5.08 22.86,5.08 22.61,4.83 22.61,4.57 21.84,3.81 18.8,3.81 18.26,4.34 U$3.80
N$122
  Top 0.127: H$121.P$1 23.11,4.57 22.1,3.56 19.3,3.56 18.67,2.85 18.67,2.03 U$3.114
N$123
  Top 0.127: H$122.P$1 23.88,5.59 23.62,5.33 22.61,5.33 22.35,5.08 22.35,4.83 21.59,4.06 19.05,4.06 18.67,4.45 U$3.79
N$124
  Top 0.127: H$123.P$1 22.86,3.81 22.35,3.3 19.56,3.3 19.05,2.79 19.05,2.11 U$3.113
N$125
  Top 0.127: H$124.P$1 24.13,6.35 23.37,5.59 22.35,5.59 22.1,5.33 22.1,5.08 21.34,4.32 19.25,4.32 19.07,4.66 U$3.78
N$126
  Top 0.127: H$125.P$1 19.81,3.05 19.46,2.69 U$3.112
N$127
  Top 0.127: H$126.P$1 24.38,7.11 23.11,5.84 22.1,5.84 21.84,5.59 19.46,5.59 19.46,5 U$3.77
N$128
  Top 0.127: H$127.P$1 21.84,2.29 20.83,1.27 20.32,1.27 19.86,1.68 19.86,2.05 U$3.111
N$130  (3 unrouted)

### Text on the board
tPlace: 1 | 20 | 2 | 19 | 32 | 3 | 31 | 30 | 29 | 28 | 27 | 18 | 4 | SpikeGadgets | 5 | 17 | GND | GND | 16 | 6 | 15 | GND | 7 | 14 | COPYRIGHT 2014 / SPIKEGADGETS LLC | 8 | 21 | 22 | 23 | 24 | 25 | 13 | 26 | 9 | 12 | 10 | 11